# EAGLE board InteractionBoard (EAGLE 9.6.2)
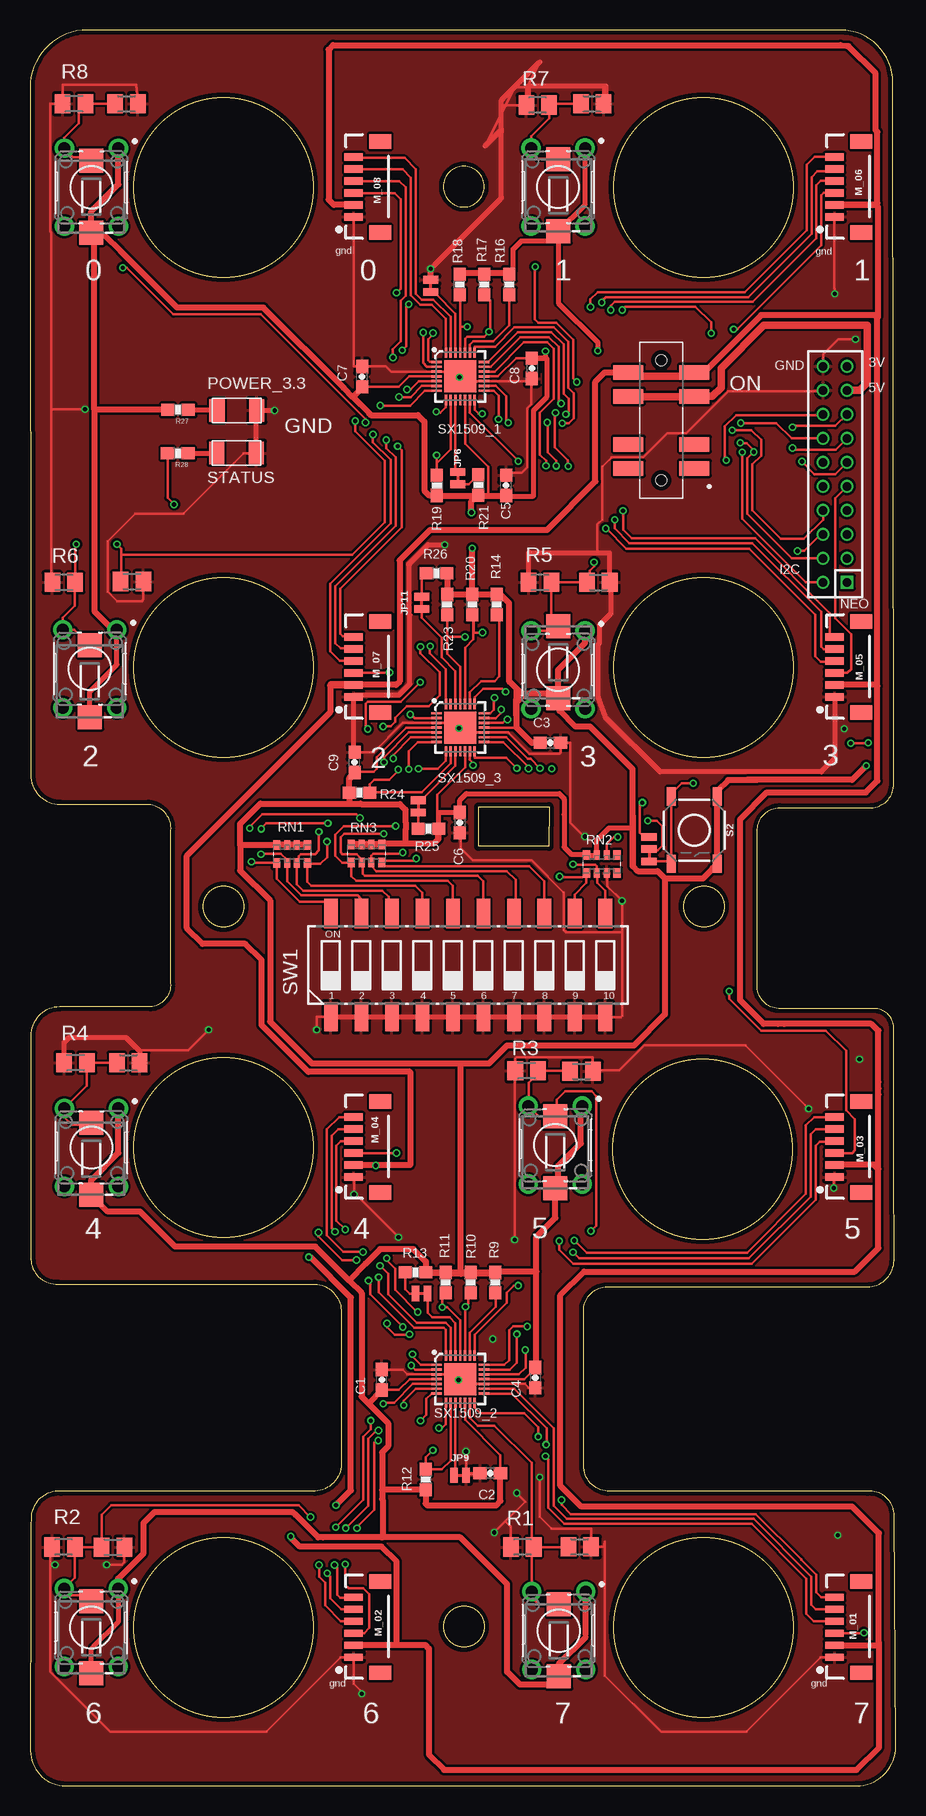
[diagram p5: board, top side]
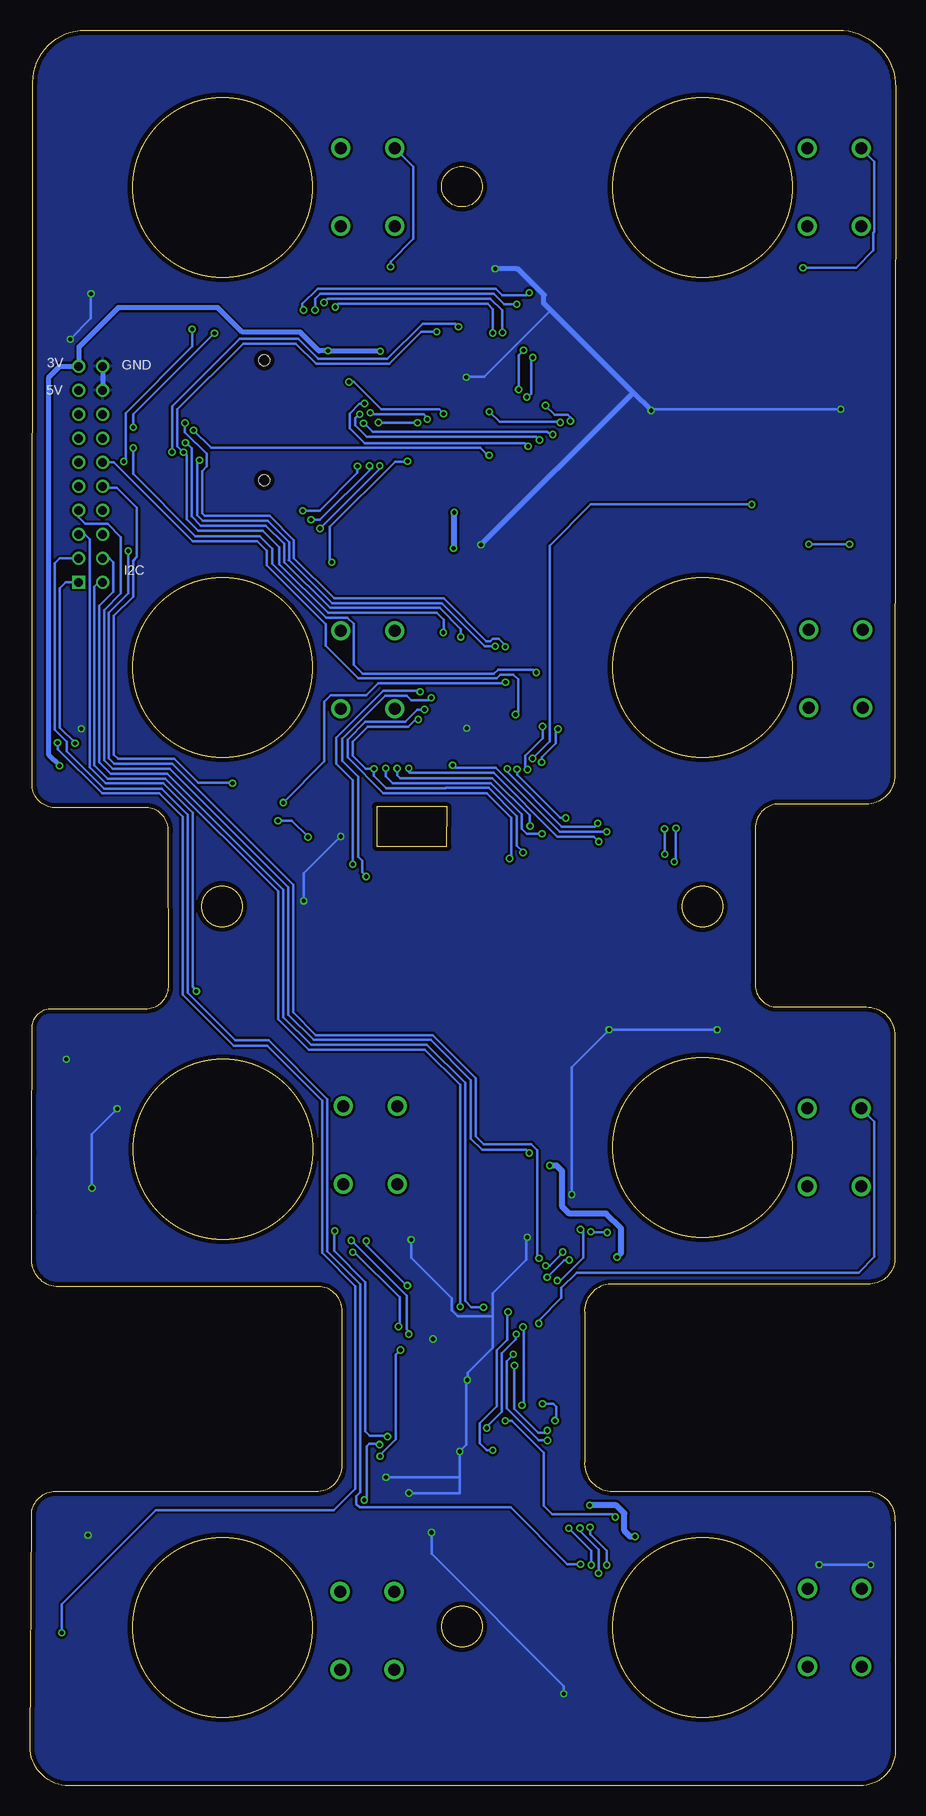
[diagram p6: board, bottom side, seen from below]

Size 72.14 x 146.32 mm. Coordinates in mm from the lower left corner, seen from the top.
Outline: 43.23,78.29 37.39,78.28 37.37,81.58 43.26,81.59 43.23,78.29
Outline: 71.97,63.21 arc87 70.33,64.77 62.38,64.77 arc-90 60.59,66.74 60.6,79.52 arc-90 62.48,81.52 70.1,81.51 arc90 71.96,83.5 71.9,141.95 arc90 67.53,146.32 4.8,146.32 arc90 0,141.51 0.06,84.23 arc90 2.49,81.8 9.88,81.8 arc-90 11.7,79.61 11.7,66.9 arc-90 10.02,64.9 2.46,64.9 arc90 0.06,62.5 0.06,43.87 arc90 2.34,41.81 23.74,41.81 arc-90 25.93,39.41 25.93,27.03 arc-90 23.77,24.54 2.57,24.54 arc88 0.09,22.48 0.05,21.53 0.05,10.47 0.03,10.09 0.03,2.92 arc90 2.96,0 68.89,0.01 arc90 72.14,3.28 72.01,22.7 arc90 69.81,24.54 48.12,24.54 arc-90 46.13,26.89 46.13,39.58 arc-90 48.11,41.58 69.76,41.58 arc90 72,43.79 72,47.47 71.99,47.79 71.99,52.59 71.98,52.95 71.98,57.82 71.97,58.14 71.97,63.21
Outline: 36.15,131.57 arc180 36.15,134.97 arc180 36.15,131.57
Outline: circle at 16.12,73.26 radius 1.7
Outline: circle at 36.16,13.27 radius 1.7
Outline: circle at 56.16,73.28 radius 1.7
Outline: circle at 16.12,13.2 radius 7.49
Outline: circle at 16.12,53.2 radius 7.49
Outline: circle at 16.12,133.2 radius 7.49
Outline: circle at 56.12,93.2 radius 7.49
Outline: circle at 56.12,133.2 radius 7.49
Outline: circle at 56.05,53.04 radius 7.49
Outline: circle at 16.12,93.2 radius 7.49
Outline: circle at 56.12,13.2 radius 7.49
Copper layers (1*16): Top 0.035559375mm / dielectric 1.6mm / Bottom 0.035559375mm
Design rules "oshpark-2layer-tented": minimum track width 6mil, minimum drill 10mil, track to track 6mil, track to pad 6mil, pad to pad 6mil, via to via 6mil, smd to smd 6mil, copper to edge 15mil, drill to drill 6mil, minimum pad ring 5mil, minimum via ring 5mil, stop-mask expansion 2.5mil, vias tented up to drill 20mil, thermal gap 10mil
Net classes: 0 default: width 0.2 mm, clearance 0.2 mm; 1 gnd: width 0.3 mm, clearance 0.2 mm to class 0, clearance 0.2 mm; 2 3v: width 0.2 mm, clearance 0.2 mm; 4 5v: width 0.4 mm, clearance 0.2 mm to class 0, clearance 0.2 mm

## Footprints (pad centres in the part's own frame; a part is rotated, then mirrored left to right if it is on the bottom)
0603-CAP = smd 1.1 x 1: 1 -0.85,0; 2 0.85,0
DIL-2MM-2X10 = drill 0.711 square: 1 -9,-1 | drill 0.711: 2 -9,1; 3 -7,-1; 4 -7,1; 5 -5,-1; 6 -5,1; 7 -3,-1; 8 -3,1; 9 -1,-1; 10 -1,1; 11 1,-1; 12 1,1; 13 3,-1; 14 3,1; 15 5,-1; 16 5,1; 17 7,-1; 18 7,1; 19 9,-1; 20 9,1
SMT-JUMPER_3_1-NC_TRACE_NO-SILK = smd 0.635 x 1.27: 1 -1.016,0; 2 0,0; 3 1.016,0
SMT-JUMPER_2_NC_TRACE_NO-SILK = smd 0.635 x 1.27: 1 -0.508,0; 2 0.508,0
1X06-1MM = smd 0.6 x 1.55: 1 -2.54,1.27; 2 -1.54,1.27; 3 -0.54,1.27; 4 0.46,1.27; 5 1.46,1.27; 6 2.46,1.27 | smd 1.2 x 1.8: P$1 -3.84,-0.955; P$2 3.76,-0.955
LED1206FAB = smd 1.27 x 1.905: 1 -1.651,0; 2 1.651,0
M0805 = smd 1.3 x 1.6: 1 -0.95,0; 2 0.95,0
0603-RES = smd 1.1 x 1: 1 -0.85,0; 2 0.85,0
EXB38V = smd 0.6 x 0.8: 1 -1.275,-0.75; 4 1.275,-0.75; 5 1.275,0.75; 8 -1.275,0.75 | smd 0.5 x 0.8: 2 -0.4,-0.75; 3 0.4,-0.75; 6 0.4,0.75; 7 -0.4,0.75
SW_JS207011SCQNR = smd 2.5 x 1.2: 1 -2.75,4; 2 -2.75,2; 3 -2.75,-2; 4 -2.75,-4; 5 2.75,4; 6 2.75,2; 7 2.75,-2; 8 2.75,-4 | hole 0.9: 0,5; 0,-5
TACTILE_SWITCH_SMD_5.2MM = smd 1.524 x 0.762: 1 -2.794,1.905; 2 2.794,1.905; 3 -2.794,-1.905; 4 2.794,-1.905
CTS-219-10 = smd 1.13 x 2.44: 1 -11.43,-4.3; 2 -8.89,-4.3; 3 -6.35,-4.3; 4 -3.81,-4.3; 5 -1.27,-4.3; 6 1.27,-4.3; 7 3.81,-4.3; 8 6.35,-4.3; 9 8.89,-4.3; 10 11.43,-4.3; 11 11.43,4.3; 12 8.89,4.3; 13 6.35,4.3; 14 3.81,4.3; 15 1.27,4.3; 16 -1.27,4.3; 17 -3.81,4.3; 18 -6.35,4.3; 19 -8.89,4.3; 20 -11.43,4.3
B3F-1000 = drill 1 pad 1.6: 1 -3.25,2.25; 2 3.25,2.25; 3 -3.25,-2.25; 4 3.25,-2.25
DTSM-3 = smd 2 x 2: 1 -3,0; 2 3,0
QFN-28 = smd 0.85 x 0.2: 1 -1.975,1.2; 2 -1.975,0.8; 3 -1.975,0.4; 4 -1.975,0; 5 -1.975,-0.4; 6 -1.975,-0.8; 7 -1.975,-1.2; 15 1.975,-1.2; 16 1.975,-0.8; 17 1.975,-0.4; 18 1.975,0; 19 1.975,0.4; 20 1.975,0.8; 21 1.975,1.2 | smd 0.2 x 0.85: 8 -1.2,-1.975; 9 -0.8,-1.975; 10 -0.4,-1.975; 11 0,-1.975; 12 0.4,-1.975; 13 0.8,-1.975; 14 1.2,-1.975; 22 1.2,1.975; 23 0.8,1.975; 24 0.4,1.975; 25 0,1.975; 26 -0.4,1.975; 27 -0.8,1.975; 28 -1.2,1.975 | smd 2.65 x 2.65: 29 0,0

## Placement (x,y rotation side)
C1  0.1uF  [0603-CAP]  29.32,33.83 90 top
C2  0.1uF  [0603-CAP]  38.35,26.05 180 top
C3  0.1uF  [0603-CAP]  43.36,86.91 0 top
C4  0.1uF  [0603-CAP]  42.11,34.01 270 top
C5  0.1uF  [0603-CAP]  39.67,108.37 90 top
C6  0.1uF  [0603-CAP]  35.8,80.26 270 top
C7  0.1uF  [0603-CAP]  27.68,117.43 90 top
C8  0.1uF  [0603-CAP]  41.83,118.12 270 top
C9  0.1uF  [0603-CAP]  27.05,85.29 90 top
J3  F-2X10-DIL-2MM  [DIL-2MM-2X10]  67.08,109.29 90 top
JP1  JUMPER-SMT_3_1-NC_TRACE_NO-SILK  [SMT-JUMPER_3_1-NC_TRACE_NO-SILK]  51.59,78.06 270 top
JP6  JUMPER-SMT_2_NC_TRACE_NO-SILK  [SMT-JUMPER_2_NC_TRACE_NO-SILK]  35.65,108.97 270 top
JP7  JUMPER-SMT_2_NC_TRACE_NO-SILK  [SMT-JUMPER_2_NC_TRACE_NO-SILK]  33.39,125 90 top
JP8  JUMPER-SMT_2_NC_TRACE_NO-SILK  [SMT-JUMPER_2_NC_TRACE_NO-SILK]  32.62,41.02 180 top
JP9  JUMPER-SMT_2_NC_TRACE_NO-SILK  [SMT-JUMPER_2_NC_TRACE_NO-SILK]  35.84,25.88 0 top
JP10  JUMPER-SMT_2_NC_TRACE_NO-SILK  [SMT-JUMPER_2_NC_TRACE_NO-SILK]  32.36,81.62 270 top
JP11  JUMPER-SMT_2_NC_TRACE_NO-SILK  [SMT-JUMPER_2_NC_TRACE_NO-SILK]  32.65,98.58 90 top
M_01  [1X06-1MM]  68.31,13.26 90 top
M_02  [1X06-1MM]  28.23,13.26 90 top
M_03  [1X06-1MM]  68.31,53.27 90 top
M_04  [1X06-1MM]  28.23,53.27 90 top
M_05  [1X06-1MM]  68.31,93.27 90 top
M_06  [1X06-1MM]  68.31,133.28 90 top
M_07  [1X06-1MM]  28.23,93.27 90 top
M_08  [1X06-1MM]  28.23,133.28 90 top
POWER_3.3  LEDFAB1206  [LED1206FAB]  17.24,114.61 0 top
R1  10k  [M0805]  41.03,19.9 0 top
R2  10k  [M0805]  2.8,19.9 0 top
R3  10k  [M0805]  41.39,59.59 0 top
R4  10K  [M0805]  3.8,60.25 0 top
R5  10k  [M0805]  42.51,100.28 0 top
R6  10k  [M0805]  2.82,100.28 0 top
R7  10k  [M0805]  46.85,140.16 180 top
R8  10k  [M0805]  3.67,140.16 0 top
R9  10K  [0603-RES]  38.78,41.93 90 top
R10  10K  [0603-RES]  36.74,41.93 90 top
R11  10K  [0603-RES]  34.66,41.93 90 top
R12  10K  [0603-RES]  32.97,25.52 270 top
R13  10K  [0603-RES]  32.13,42.8 0 top
R14  10K  [0603-RES]  38.9,98.43 90 top
R16  10K  [0603-RES]  39.94,125.1 90 top
R17  10K  [0603-RES]  37.86,125.11 90 top
R18  10K  [0603-RES]  35.81,125.1 90 top
R19  10K  [0603-RES]  33.91,108.37 270 top
R20  10K  [0603-RES]  36.84,98.43 90 top
R21  10K  [0603-RES]  37.37,108.4 270 top
R23  10K  [0603-RES]  34.75,98.43 90 top
R24  10K  [0603-RES]  27.47,82.76 180 top
R25  10K  [0603-RES]  33.21,79.76 0 top
R26  10K  [0603-RES]  33.89,101.05 0 top
R27  500  [0603-RES]  12.34,114.66 180 top
R28  500  [0603-RES]  12.31,111.04 180 top
RN1  [EXB38V]  21.84,77.65 0 top
RN2  [EXB38V]  47.64,76.81 0 top
RN3  [EXB38V]  28.04,77.68 0 top
S1  JS207011SCQNR  [SW_JS207011SCQNR]  52.61,113.78 180 top
S2  [TACTILE_SWITCH_SMD_5.2MM]  55.35,79.64 270 top
STATUS  LEDFAB1206  [LED1206FAB]  17.21,111.06 0 top
SW1  219-10  [CTS-219-10]  36.51,68.38 0 top
SWB_1  B3F-1000  [B3F-1000]  44.06,12.93 270 top
SWB_2  B3F-1000  [B3F-1000]  5.09,13.19 270 top
SWB_3  B3F-1000  [B3F-1000]  43.78,53.4 270 top
SWB_4  B3F-1000  [B3F-1000]  5.12,53.19 270 top
SWB_5  B3F-1000  [B3F-1000]  44.01,93 270 top
SWB_6  B3F-1000  [B3F-1000]  4.99,93.09 270 top
SWB_7  B3F-1000  [B3F-1000]  44.01,133.23 270 top
SWB_8  B3F-1000  [B3F-1000]  5.12,133.2 270 top
SWITCH_M1  DTSM-3  [DTSM-3]  44.08,12.12 90 top
SWITCH_M2  DTSM-3  [DTSM-3]  5.09,12.37 90 top
SWITCH_M3  DTSM-3  [DTSM-3]  43.78,52.77 90 top
SWITCH_M4  DTSM-3  [DTSM-3]  5.08,52.27 90 top
SWITCH_M5  DTSM-3  [DTSM-3]  44.01,93.64 90 top
SWITCH_M6  DTSM-3  [DTSM-3]  4.99,92.05 90 top
SWITCH_M7  DTSM-3  [DTSM-3]  44.03,132.55 90 top
SWITCH_M8  DTSM-3  [DTSM-3]  5.12,132.44 90 top
SWR_1  10K  [M0805]  45.81,19.92 180 top
SWR_2  10K  [M0805]  6.92,19.89 180 top
SWR_3  10K  [M0805]  45.96,59.53 180 top
SWR_4  10K  [M0805]  8.19,60.25 180 top
SWR_5  10K  [M0805]  47.36,100.28 180 top
SWR_6  10K  [M0805]  8.49,100.35 180 top
SWR_7  10K  [M0805]  42.31,140.06 0 top
SWR_8  10K  [M0805]  8.04,140.16 180 top
SX1509_2  SX1509  [QFN-28]  35.85,33.89 0 top
SX1509_3  SX1509  [QFN-28]  35.85,88.18 0 top
U2  SX1509  [QFN-28]  35.85,117.45 0 top

## Tracks (layer width: path | path; a pad name or v marks a point on that pad's centre or on a via)
0_SX1  (via drill 0.35)
  Top 0.2: M_04.6 25.76,55.73 24.73,54.7 24.73,45.9 26.11,44.51 27.73,44.51 v27.75,44.49 | SX1509_2.27 35.05,38.17 34.65,38.57 32.22,38.57 29.83,40.96 29.83,42.68 v29.17,43.34
  Bottom 0.2: v29.17,43.34 28.81,43.34 27.75,44.4 v27.75,44.49
0_SX2
  Top 0.2: U2.27 35.05,122.41 33.61,123.85 32.65,123.85 32.15,124.35 32.15,134.73 31.22,135.67 27.03,135.67 M_08.6
1_SX1  (via drill 0.35)
  Top 0.2: M_04.5 25.68,54.73 25.13,54.18 25.13,46.46 v25.41,46.18 | SX1509_2.28 34.65,38.01 34.49,38.17 32.02,38.17 29.05,41.14 v29.05,42.37 | v27.21,43.81 26.01,43.81 24.03,45.78 v24.03,46.11
  Bottom 0.2: v25.41,46.18 25.34,46.11 v24.03,46.11 | v27.21,43.81 27.61,43.81 v29.05,42.37
1_SX2
  Top 0.2: M_08.5 27,134.7 31.05,134.7 31.74,134 31.74,124.19 32.5,123.43 33.47,123.43 34.65,122.25 U2.28
1_SX3  (via drill 0.35)
  Top 0.2: SX1509_3.28 34.65,93.04 33.3,94.39 33.3,94.9 v33.36,94.96 | v58.01,110.47 57.9,110.58 57.9,113.29 58.84,114.23 65.77,114.23 65.83,114.29 J3.16
  Bottom 0.2: v33.36,94.96 34.25,94.96 37.84,98.55 46.98,98.55 50.55,102.12 | 50.55,102.12 50.57,102.14 | 50.55,102.12 50.55,103.63 52.34,105.42 57.73,105.42 58.2,105.89 58.2,110.47 v58.01,110.47
2_SX1  (via drill 0.35)
  Top 0.2: SX1509_2.1 32.57,35.09 31.87,35.78 v31.87,35.95 | M_02.6 26.91,15.67 25.87,15.67 25.62,15.92 25.62,18.16 v25.37,18.4 | v27.25,21.46 27.25,21.57 28.67,22.99 28.67,28.57 28.86,28.76 29,28.76 v29.02,28.78
  Bottom 0.2: v31.87,35.95 31.87,35.91 32.41,35.37 32.41,31.48 29.74,28.81 29.05,28.81 v29.02,28.78 | v25.37,18.4 25.37,19.58 v27.25,21.46
2_SX2  (via drill 0.35)
  Top 0.2: M_06.6 67.02,135.76 65.41,135.76 64.73,135.08 64.73,129.63 59.56,124.46 47.3,124.46 46.7,123.86 v46.7,123.23 | U2.1 33.32,118.65 33.18,118.79 33.18,120.56 33.58,120.96 v33.58,121.07
  Bottom 0.2: v33.58,121.07 33.6,121.09 33.58,121.1 33.58,123.06 34.01,123.49 46.44,123.49 v46.7,123.23
3.3V  (via drill 0.35)
  Top 0.2: U2.18 38.99,117.45 40.51,118.97 41.66,118.97 C8.1 | U2.4 31.61,117.45 30.73,116.58 C7.1 | 37.24,107.52 37.34,107.52 R21.2 38.18,107.55 | 38.18,107.55 38.43,107.55 38.43,107.52 C5.1 39.6,107.44 39.6,107.39 | 27.24,84.44 C9.1 27.11,84.49 28.66,84.49 28.91,84.73 28.91,85.72 31.36,88.18 SX1509_3.4 | R23.2 34.88,99.28 R20.2 36.98,99.28 38.76,99.28 R14.2 | C4.1 42.11,34.81 41.18,33.89 SX1509_2.18 | SX1509_2.4 31.65,33.89 30.74,32.98 C1.1 | R18.2 35.82,125.96 R17.2 39.93,125.96 R16.2 | SX1509_3.12 36.25,84.89 33.93,82.58 33.93,79.89 R25.2 | SX1509_2.12 36.25,30.5 39.2,27.55 C2.1 | U2.12 36.25,111.84 38.18,109.91 38.18,107.55 | SX1509_3.18 40.55,88.18
  Top 0.305: 34.45,79.76 34.13,79.76 R25.2 | R26.2 34.74,99.43 34.88,99.28 | R23.2 36.98,99.28 | R20.2 38.76,99.28 | 37.24,107.52 39.47,107.52 39.6,107.39 | R18.2 R16.2 | 50.25,80.88 50.25,81 | 50.25,81 50.27,81.02 | 50.25,81 50.25,84.68 | 27.05,84.26 C9.1 26.62,84.01 26.62,82.88 26.44,82.69
  Top 0.4: R13.2 33.1,42.68 34.56,42.68 R11.2 34.78,42.66 35.9,42.66 36.62,42.66 R10.2 36.81,42.71 38.71,42.71 R9.2 38.88,42.88 40.51,42.88 40.74,42.88 | 43.49,49.49 SWITCH_M3.1 | 43.48,90.64 SWITCH_M5.1 | RN3.5 RN3.7 RN3.8 26.89,78.55 28.56,78.55 | RN1.8 RN1.7 RN1.5 | C8.1 43.05,118.97 43.05,115.71 41.94,114.6 41.94,107.49 41.89,107.44 39.75,107.44 C5.1 | 26.88,115.79 28.44,114.23 | 26.17,116.5 19.49,123.18 12.25,123.18 | R16.2 40.06,126.07 40.25,126.26 40.25,128.05 40.93,128.73 43.21,128.73 SWITCH_M7.1 | SWITCH_M7.1 46.26,131.77 SWB_7.1 | v42.95,119.55 42.95,118.97 41.66,118.97 | SWITCH_M7.1 44.03,123.57 47.31,120.28 v47.31,119.58 | 57.33,82.97 57.33,82.5 S2.1 | SWITCH_M6.1 4.99,91.19 7.24,93.44 7.24,96.09 SWB_6.1 6.91,96.34 5.37,97.88 | 34.06,79.69 34.13,79.76 | 34.06,79.69 R25.2 34.06,81.11 C6.1 35.82,81.12 35.82,82.13 36.37,82.68 44.1,82.68 | 34.06,79.69 34.06,78.92 34.02,78.88 | RN3.6 28.56,78.55 | 28.56,78.55 29.44,78.55 31.27,78.55 31.38,78.55 | 31.38,78.55 33.69,78.55 | 50.25,79.82 50.25,80.88 50.25,84.68 | 50.25,79.82 50.25,76.62 | 44.08,90.56 44.14,90.51 44.51,90.14 | 50.25,79.82 48.26,79.82 47.24,78.8 RN2.7 RN2.8 46.34,77.59 45.15,77.59 44.52,78.22 | RN1.5 23.03,78.31 | 5.27,11.57 5.09,11.39 | 9.47,21.91 10.42,22.85 21.84,22.85 22.13,22.57 | 24.43,20.69 28.5,20.69 | 29.04,32.7 C1.1 | 32.83,24.53 R12.2 | SWITCH_M8.1 5.37,129.19 5.37,128.91 | RN1.6 RN1.5 | 31.37,78.56 31.38,78.55 | 26.62,82.09 R24.2
  Top 0.406: 28.5,20.69 29.27,20.69 29.39,20.69 35.87,20.69 | 40.97,91.01 40.78,90.81 40.55,90.58 40.55,88.18 | 50.25,84.68 50.22,84.71 | 44.1,82.68 44.52,82.27 44.52,82.2 44.52,80.95 | 44.52,80.95 | 44.52,80.95 44.52,78.23 44.52,78.22 | 46.31,12.39 46.31,12.66 | 46.31,15.94 SWB_1.1 | SWITCH_M2.1 5.09,11.39 | SWB_2.1 7.34,13.64 5.27,11.57
  Top 0.508: 35.9,42.66 35.9,60.14 35.84,60.2 | S2.2 57.33,76.91 | 56.88,76.46 S2.2 | 60.58,83.82 59.7,83.82 | 59.7,83.82 58.17,83.82 57.33,82.97 | v69.68,85 68.51,83.82 59.71,83.82 59.7,83.82 | 26.6,42.11 23.77,44.93 12.1,44.93 9.17,47.86 6.49,47.86 SWITCH_M4.1 5.08,50.46 7.37,52.75 SWB_4.1 | 17.51,78.38 17.53,78.4 RN1.8 RN1.5 | 17.51,78.38 17.51,80.16 19.2,81.85 26.62,81.85 | R24.2 26.62,84.01 C9.1 | R24.2 26.62,83.84 27.05,84.26 | 17.51,78.38 17.51,76.27 20,73.78 20,63.68 23.49,60.2 35.84,60.2 | 29.34,24.67 29.34,27.79 29.83,28.28 29.83,30.23 28.22,31.85 | 29.39,20.69 29.39,20.81 | 29.39,23.85 29.39,24.76 | SWB_3.1 46.03,56.38 45.91,56.26 45.91,53.55 43.99,51.63 43.99,49.98 SWITCH_M3.1 43.78,47.33 42.19,45.74 42.19,42.84 | 42.24,87.19 C3.1 41.82,86.91 40.55,88.18 | SWITCH_M5.1 44.08,90.56 | SWITCH_M5.1 43.64,91.01 41.24,91.01 | 41.24,91.01 40.97,91.01 40.5,91.48 | R26.2 34.75,101.04 R23.2 R14.2 39.2,99.28 39.9,98.58 39.9,92.07 39.98,92 40.5,91.48 | 37.24,107.52 R19.2 33.28,107.52 32.87,107.92 32.87,113.68 32.32,114.23 28.44,114.23 28.41,114.23 28.28,114.37 28.26,114.37 26.9,115.73 | 37.24,107.52 C5.1 39.75,107.44 | R18.2 35.93,126.07 40.06,126.07 | 40.5,91.48 40.5,90.53 | 40.5,90.27 41.24,91.01 | 52.89,75.62 52.3,76.21 50.66,76.21 50.25,76.62 50.22,76.65 50.22,84.71 46.67,88.26 45.45,88.26 44.14,89.58 44.14,90.51 SWITCH_M5.1 | 52.89,75.62 56.09,75.62 57.26,76.79 S2.2 | 52.89,75.62 52.91,75.59 52.91,64.28 50.33,61.7 39.75,61.7 38.25,60.2 35.84,60.2 | 28.22,31.85 27.63,32.43 27.63,41.07 26.6,42.11 | 28.22,31.85 28.22,31.88 C1.1 | R12.2 29.34,24.67 | 40.51,42.88 42.16,42.88 42.19,42.84
  Top 0.508: 42.19,42.84 38.84,42.84 38.71,42.71 | 34.78,42.66 38.66,42.66 R9.2 38.75,42.8 R13.2 32.98,43.68 31.94,44.71 29.18,44.71 27.98,43.51 27.98,43.48 26.6,42.11 | C4.1 42.19,34.95 42.19,42.84 | 40.55,88.18 40.55,89.18 40.5,89.23 40.5,90.27 | 40.5,90.27 40.5,90.53 | 40.5,90.53 40.78,90.81 | R12.2 32.97,23.5 33.1,23.37 38.83,23.37 39.2,23.74 C2.1 | 46.31,12.39 44.08,10.17 SWITCH_M1.1 43.39,8.43 40.83,8.43 39.76,9.5 39.76,16.8 35.87,20.69 29.27,20.69 | 46.31,12.66 46.31,15.94 | 29.27,20.69 24.43,20.69 24,20.69 22.13,22.57 21.87,22.83 10.39,22.83 9.47,21.91 9.47,19.39 7.34,17.26 SWB_2.1 | SWITCH_M5.1 44.01,92.99 46.26,95.24 SWB_5.1 | 27.6,116.5 C7.1 27.68,116.5 26.9,115.73 | 26.17,116.5 26.13,116.5 | 26.13,116.5 19.45,123.18 12.26,123.18 12.25,123.18 7.55,127.88 7.55,127.9 6.27,129.19 5.37,129.19 | SWITCH_M8.1 5.12,131.2 7.37,133.45 SWB_8.1 | R27.2 5.37,114.66 | 5.37,114.66 5.37,128.91 | 5.37,114.66 5.37,97.88 7.16,96.09 7.24,96.09 | R20.2 v36.84,103.13 | v36.78,106.1 36.78,107.06 37.24,107.52 | 29.34,24.67 29.34,23.9 29.39,23.85 | R12.2 33.02,24.67 | 29.39,23.85 29.39,20.81 | 29.39,20.81 29.27,20.69 | 26.13,116.5 26.9,115.73 | S2.2 S2.1 | R24.2 26.62,81.85 | 26.63,81.86 26.62,81.85 | 26.62,81.85 27.54,81.85 27.59,81.81 30.82,81.81 31.27,81.36 31.27,80.33 31.29,80.31 31.29,79.69 31.27,79.67 31.27,78.55 | RN3.5 29.44,78.55 33.69,78.55 34.02,78.88 34.02,79.72 R25.2
  Bottom 0.4: 64.8,123.18 68.05,119.93 68.05,118.32 J3.19 69.66,118.29 70.57,117.38 70.57,85.89 v69.68,85 | v42.95,119.55 42.97,119.57 v47.3,119.57 v47.31,119.58 48,119.58
  Bottom 0.406: 48,119.58 48.07,119.58 49.63,121.15 54.45,121.15 56.48,123.18 64.8,123.18
  Bottom 0.508: v36.84,103.13 36.84,106.04 v36.78,106.1
3_SX1  (via drill 0.35)
  Top 0.2: M_02.5 25.95,14.72 25.04,15.63 25.04,17.43 v24.76,17.71 | SX1509_2.2 32.09,34.69 31.77,35 v31.77,35.02 | v29.04,29.61 28.9,29.61 28.19,28.9 28.19,23.34 26.32,21.47 v26.31,21.47
  Bottom 0.2: v31.77,35.02 31.77,31.41 29.79,29.42 29.23,29.42 v29.04,29.61 | v26.31,21.47 26.31,21.23 24.77,19.69 v24.77,17.72 v24.76,17.71
3_SX2  (via drill 0.35)
  Top 0.2: M_06.5 66.84,134.53 65.61,134.53 65.13,134.05 65.13,129.34 59.86,124.06 47.98,124.06 47.65,123.74 v47.65,123.61 | v32.76,121.1 32.76,118.57 33.08,118.25 U2.2
  Bottom 0.2: v32.76,121.1 32.78,121.1 32.78,122.94 33.77,123.93 47.34,123.93 47.65,123.62 v47.65,123.61
3_SX3  (via drill 0.35)
  Top 0.2: SX1509_3.2 32.08,88.98 31.77,89.28 v31.68,89.28
  Bottom 0.2: J3.12 65.15,110.29 58.58,103.72 53.21,103.72 52.4,102.91 52.4,101.72 47.5,96.82 47.5,95 44.78,92.28 33.25,92.28 32.95,92.59 31.85,92.59 31.47,92.2 31.47,89.5 v31.68,89.28
4_SX1  (via drill 0.35)
  Top 0.2: M_02.4 25.9,13.72 24.6,15.02 24.6,16.92 24.08,17.43 v24.08,18.39 v24.09,18.39 | v28.39,30.43 28.39,29.69 27.79,29.09 27.79,23.85 v25.48,21.54 v25.47,21.54 | v29.43,31.83 29.53,31.93 30.34,31.93 31.89,33.49 SX1509_2.5
  Bottom 0.2: v24.09,18.39 24.09,18.69 24.1,18.7 24.1,19.59 25.47,20.96 v25.47,21.54 | v28.39,30.43 28.27,30.55 28.27,31.57 28.53,31.83 v29.43,31.83
4_SX2  (via drill 0.35)
  Top 0.2: U2.5 32.41,117.05 31.72,116.36 v31.42,116.36 | M_06.4 65.9,133.74 65.53,133.37 65.53,128.95 60.24,123.66 48.72,123.66 48.39,123.33 v48.39,122.98 | v31.57,123.46 31.37,123.26 31.37,119.98 v31.02,119.63
  Bottom 0.2: v31.57,123.46 32.63,123.46 33.5,124.33 47.96,124.33 48.39,123.91 v48.39,122.98 | v31.02,119.63 31.42,119.23 v31.42,116.36
4_SX3  (via drill 0.35)
  Top 0.2: v29.51,85.3 29.51,85.73 31.56,87.78 SX1509_3.5 | JP1.1 51.48,79.18 51.07,79.18 50.81,79.44 50.81,81.78 50.95,81.93 v51.03,81.93 | v32.51,91.95 30.9,90.33 28.16,90.33 27.99,90.16 27.99,88.06 v28.14,88.06
  Bottom 0.2: v51.03,81.93 47.61,85.36 47.61,90.32 47.06,90.86 44.13,90.86 43.13,91.87 32.45,91.87 32.45,91.89 v32.51,91.95 | v28.14,88.06 28.34,87.86 28.34,86.9 29.51,85.73 v29.51,85.3
5_SX1  (via drill 0.35)
  Top 0.2: M_04.4 25.92,53.73 25.53,53.34 25.53,47.1 v26.27,46.36 | SX1509_2.6 32.14,33.09 31.14,32.09 v31.14,31.71 | v28.21,42.1 28.33,41.98 28.33,40.98 31.06,38.25 v31.06,38.23
  Bottom 0.2: v26.27,46.36 26.06,46.16 26.06,43.99 27.95,42.1 v28.21,42.1 | v31.06,38.23 31.01,38.18 31.01,31.84 v31.14,31.71
5_SX2  (via drill 0.35)
  Top 0.2: M_08.4 26.99,133.71 30.78,133.71 31.29,133.19 31.29,124.16 30.89,123.76 30.89,120.38 30.24,119.73 v30.24,119.03 | v30.74,115.73 31.74,115.73 32.67,116.65 U2.6
  Bottom 0.2: v30.74,115.73 30.67,115.73 30.38,116.02 30.38,118.89 v30.24,119.03
5_SX3  (via drill 0.35)
  Top 0.2: SX1509_3.6 31.75,87.38 30.26,85.89 v30.26,85.61 | R28.2 11.46,107.32 v12,106.78
  Bottom 0.2: v30.26,85.61 28.82,87.05 28.82,103.35 25.39,106.78 v12,106.78
6_SX1  (via drill 0.35)
  Top 0.2: SWITCH_M2.2 4.57,15.9 3.38,15.9 SWB_2.3 3.73,17.32 3.73,19.88 R2.2 5.96,19.9 SWR_2.2 5.97,22.6 6.76,23.38 22.38,23.38 v23.37,22.39 | SX1509_2.7 33.87,32.68 33.46,32.68 33.03,32.25 33.03,30.9 v32.55,30.41
  Bottom 0.2: v23.37,22.39 23.6,22.62 28.62,22.62 29.32,23.32 29.32,27.74 32,30.41 v32.55,30.41
6_SX2  (via drill 0.35)
  Top 0.2: R6.2 3.72,100.23 3.72,98.33 2.74,97.36 SWB_6.3 3.7,96.34 SWITCH_M6.2 | R6.2 3.84,100.35 | U2.7 32.91,116.25 31.69,115.02 v29.19,115.02 | 7.61,100.42 SWR_6.2 | v27.11,113.73 27.11,113.6 27.12,113.59 27.12,112.86 29.57,110.41 29.57,105.3 26.85,102.58 7.61,102.58 7.61,103.08 v7.24,103.45 | R6.2 3.77,103.37 v3.84,103.45
  Top 0.203: 7.61,102.58 7.61,100.42
  Bottom 0.2: v29.19,115.02 28.41,114.25 27.32,114.25 27.11,114.04 v27.11,113.73 | v3.84,103.45 v7.24,103.45
6_SX3  (via drill 0.35)
  Top 0.2: SW1.20 25.08,73.56 24.96,73.68 22.49,73.68 20.57,75.61 RN1.1 18.57,76.9 v18.46,77.01 | SX1509_3.7 33.85,86.95 32.3,86.95 31.55,86.2 v31.55,84.72 | v18.32,79.79 18.32,79.92 19.35,80.95 27.19,80.95 v27.49,80.65
  Bottom 0.2: v31.55,84.72 31.55,84.26 27.94,80.65 v27.49,80.65 | v18.46,77.01 18.32,77.16 v18.32,79.79
7_SX1  (via drill 0.35)
  Top 0.2: SWR_4.2 R4.2 4.75,58.32 SWB_4.3 2.87,55.73 3.52,55.08 4.97,55.08 5.08,55.2 SWITCH_M4.2 | SX1509_2.8 34.65,30.12 34.32,29.79 34.1,29.79 v34.07,29.82 | v31.62,37.64 31.56,37.58 30.41,37.58 29.75,38.23 v29.75,38.53
  Bottom 0.2: v34.07,29.82 34.07,29.92 32.83,31.16 32.83,36.04 31.66,37.21 31.66,37.6 v31.62,37.64 | SWB_4.3 1.77,55.34 1.77,44.07 3.06,42.77 26.59,42.77 27.85,41.51 27.85,40.65 29.71,38.8 29.6,38.69 v29.75,38.53
7_SX2  (via drill 0.35)
  Top 0.2: SWR_8.2 R8.2 4.07,139.62 4.07,138.56 2.87,137.35 SWB_8.3 3.62,135.7 4.86,135.7 SWITCH_M8.2 | U2.8 34.65,114.87 34.2,114.42 33.94,114.42 v33.86,114.5 | v27.96,113.61 27.96,113.88 19.22,122.62 11.95,122.62 8.08,126.5 v7.73,126.5
  Bottom 0.2: v27.96,113.61 28,113.65 33.01,113.65 v33.86,114.5 | v7.73,126.5 3.31,126.5 1.86,127.94 1.86,129.4 1.77,129.5 1.77,135.35 SWB_8.3
7_SX3  (via drill 0.35)
  Top 0.2: SW1.19 27.56,72.74 27.56,73.94 27.29,74.2 22.62,74.2 21.44,75.38 RN1.2 21.44,77.15 20.91,77.68 19.3,77.68 v19.24,77.62 | v24.82,80.2 19.69,80.2 19.27,79.79 v19.27,79.74 | v32.38,84.75 33.98,84.75 34.65,85.42 SX1509_3.8
  Bottom 0.2: v24.82,80.2 24.82,80.17 25.06,79.93 27.82,79.93 32.38,84.49 v32.38,84.75 | v19.27,79.74 19.24,79.71 v19.24,77.62
8_SX1
  Top 0.2: SWITCH_M1.2 42.34,15.12 41.81,15.65 SWB_1.3 41.81,19.73 R1.2 | R1.2 44.84,19.9 SWR_1.2 | SX1509_2.13 36.65,30.66 37.29,30.02 38.7,30.02 41.82,26.9 41.82,20.05 R1.2
8_SX2  (via drill 0.35)
  Top 0.2: SWB_5.3 43.62,96.25 SWITCH_M5.2 43.46,97.19 R5.2 SWR_5.2 46.41,100.63 46.63,100.85 46.63,101.25 47,101.62 v47,101.95 | U2.13 36.65,114.43 40.68,110.41 v40.68,110.39
  Bottom 0.2: v40.68,110.39 40.71,110.36 41.71,110.36 47.16,104.91 47.16,102.11 v47,101.95
8_SX3  (via drill 0.35)
  Top 0.2: SW1.18 29.88,72.96 29.88,74.07 29.35,74.6 22.79,74.6 22.24,75.15 RN1.3 22.39,77.05 22.39,77.48 22.55,77.64 23.76,77.64 24.07,77.96 v24.07,79.51 | SX1509_3.13 36.65,85.49 36.92,85.22 v36.92,85.05
  Bottom 0.2: v36.92,85.05 36.71,84.84 33.33,84.84 27.99,79.51 v24.07,79.51
9_SX1  (via drill 0.35)
  Top 0.2: SWR_3.2 44.95,59.59 R3.2 42.34,59.39 41.55,58.6 41.55,56.66 SWB_3.3 42.4,55.77 SWITCH_M3.2 43.91,55.91 43.91,57.16 44.62,57.87 46.8,57.87 47.19,57.48 47.19,46.69 v46.74,46.24 | SX1509_2.14 37.05,31.51 37.51,31.05 41.19,31.05 42.35,29.9 v42.35,29.1
  Bottom 0.2: v42.35,29.1 42.43,29.18 43.83,29.18 44.19,29.54 44.19,41.98 46.8,44.59 46.8,46.18 v46.74,46.24
9_SX2  (via drill 0.35)
  Top 0.2: R7.2 43.36,140.16 SWR_7.2 43.26,138.96 41.76,137.46 SWB_7.3 41.76,136.09 42.27,135.58 44,135.58 SWITCH_M7.2 | U2.14 37.06,115.47 37.06,114.68 37.41,114.34 v37.69,114.34 | v42.09,126.59 42.06,126.56 42.06,122.22 42.35,121.93 43.84,121.93 45.27,120.5 45.27,117.67 45.26,117.68 45.26,117.28 v45.55,116.99
  Bottom 0.2: v37.69,114.34 38.04,114.69 42.86,114.69 45.16,116.99 v45.55,116.99 | v42.09,126.59 42.09,127.01 40.19,128.91 40.19,134.92 SWB_7.3
9_SX3  (via drill 0.35)
  Top 0.2: 32.7,73.43 SW1.17 32.7,74.4 32.1,75 23.43,75 23.12,75.32 RN1.4 23.2,76.82 24.21,76.82 24.75,77.37 v24.75,78.68 | 37.05,85.78 SX1509_3.14 37.05,85.66 39.7,85.66 v40.57,84.79
  Bottom 0.2: v24.75,78.68 25.18,79.11 28.19,79.11 33.5,84.42 38.28,84.42 40.49,84.42 40.57,84.5 v40.57,84.79
10_SX1  (via drill 0.35)
  Top 0.2: M_01.6 65.92,15.72 65.5,16.14 65.5,17.6 64.27,18.83 64.27,18.86 60.49,22.64 45.06,22.64 44.29,23.41 v44.29,23.81 | v43.01,28.43 43.05,28.48 43.05,29.8 40.16,32.69 SX1509_2.15
  Bottom 0.2: 44.2,23.81 v44.29,23.81 44.25,23.81 44.09,23.97 44.09,28.29 43.88,28.5 43.08,28.5 v43.01,28.43 v43,28.43
10_SX2  (via drill 0.35)
  Top 0.2: M_05.6 66.88,95.73 66.67,95.95 66.67,97.72 60.43,103.95 50.14,103.95 49.44,104.65 49.44,106.23 v49.41,106.26 | v43.79,114.41 43.72,114.34 43.72,111.53 44.8,110.45 44.8,110.01 v44.85,109.96 | v39.04,113.88 39.04,115.84 38.63,116.25 U2.15
  Bottom 0.2: v43.79,114.41 43.67,114.29 39.32,114.29 39.04,114.01 v39.04,113.88 | v49.41,106.26 47.99,106.26 44.85,109.4 v44.85,109.96
10_SX3  (via drill 0.35)
  Top 0.2: SW1.16 35.24,74.99 34.83,75.4 27.19,75.4 26.78,75.81 26.78,76.92 RN3.1 26.01,76.93 25.45,77.49 25.45,79.25 26.16,79.96 30.45,79.96 v30.47,79.98 | SX1509_3.15 39.45,86.98 41.55,84.88 v41.55,84.78
  Bottom 0.2: v30.47,79.98 30.52,79.93 30.52,80.87 33.61,83.96 41.28,83.96 41.55,84.23 v41.55,84.78
11_SX1
  Top 0.2: M_01.5 65.46,14.72 65.1,15.08 65.1,17.44 60.3,22.24 44.72,22.24 43.64,23.32 43.64,29.78 40.34,33.09 SX1509_2.16
11_SX2  (via drill 0.35)
  Top 0.2: M_05.5 67.02,94.71 66.14,94.71 65.92,94.94 65.92,97.83 60.19,103.55 49.95,103.55 48.72,104.78 v48.72,105.5 | U2.16 38.83,116.65 39.69,115.79 39.69,113.75 v39.85,113.59 | v43.85,109.99 43.85,110.4 43.13,111.12 43.13,113.58 v43.1,113.61
  Bottom 0.2: v43.1,113.61 43.08,113.59 v39.85,113.59 | v43.85,109.99 43.67,109.81 47.98,105.5 v48.72,105.5
11_SX3  (via drill 0.35)
  Top 0.2: SW1.15 37.78,75.37 37.33,75.82 27.88,75.82 27.71,75.99 27.71,76.86 RN3.2 27.66,76.95 27.66,77.22 27.24,77.63 26.03,77.63 25.88,77.78 25.88,79.05 26.18,79.34 v29.47,79.34 | SX1509_3.16 39.68,87.38 41.47,85.58 41.71,85.58 42.49,84.8 v42.5,84.8
  Bottom 0.2: v29.47,79.34 29.59,79.34 29.6,79.35 30.77,79.35 31.16,79.74 31.16,80.95 33.76,83.55 37.86,83.55 37.87,83.55 41.92,83.55 42.5,84.13 v42.5,84.8
12_SX1  (via drill 0.35)
  Top 0.2: M_01.4 65.32,13.72 64.7,14.33 64.7,17.27 60.14,21.84 44.54,21.84 43.2,23.19 43.2,27.22 v42.97,27.45 | SX1509_2.19 40.74,34.29 41.3,34.85 41.3,36.27 v41.26,36.31
  Bottom 0.2: v41.26,36.31 41.66,35.91 41.66,28.89 42.97,27.59 v42.97,27.45
12_SX2  (via drill 0.35)
  Top 0.2: M_05.4 66.99,93.68 65.88,93.68 65.46,94.11 65.46,97.6 59.95,103.1 49.7,103.1 48.02,104.78 v47.97,104.78 | U2.19 38.73,117.85 41.16,120.28 43.09,120.28 43.63,119.74 43.63,115.57 42.48,114.42 42.48,110.93 43,110.41 v43,110.01
  Bottom 0.2: v43,110.01 43,109.75 v47.97,104.78
12_SX3  (via drill 0.35)
  Top 0.2: 39.99,72.68 SW1.14 40.47,72.84 40.47,75.49 39.74,76.23 28.87,76.23 28.48,76.62 28.48,76.89 RN3.3 28.44,77.49 28.6,77.65 30.94,77.65 v31.06,77.77 | v39.78,88.86 v39.79,88.87 39.68,88.87 39.39,88.58 SX1509_3.19
  Bottom 0.2: v31.06,77.77 31.06,77.82 31.58,78.34 31.58,80.8 33.93,83.15 37.5,83.15 42.46,83.15 43.48,84.17 v43.48,84.75 44.16,84.75 45.23,85.83 45.23,87.01 44,88.23 40.63,88.23 40,88.86 v39.78,88.86
13_SX1  (via drill 0.35)
  Top 0.2: M_03.6 67.03,55.71 65.34,55.71 64.67,55.03 64.67,49.32 59.76,44.42 46.39,44.42 v45.36,45.45 | v40.57,37.64 40.57,35.27 39.99,34.69 SX1509_2.20
  Bottom 0.2: v45.36,45.45 45.15,45.24 40.74,40.82 40.74,38.03 40.57,37.87 v40.57,37.64
13_SX2  (via drill 0.35)
  Top 0.2: M_07.6 26.91,95.78 26.06,95.78 25.84,96.01 25.84,99.75 30.96,104.87 30.96,111.29 v30.63,111.62 | U2.20 38.39,118.25 40.86,120.73 43.24,120.73 44.06,119.91 44.06,115.4 v44.26,115.2
  Bottom 0.2: v30.63,111.62 30.9,111.89 44.26,111.89 45.51,113.14 45.51,114.34 44.69,115.16 44.26,115.16 v44.26,115.2
13_SX3  (via drill 0.35)
  Top 0.2: SW1.13 42.86,75.38 41.6,76.64 29.61,76.64 RN3.4 29.47,77.08 31.99,77.08 v32.18,77.28 | v39.26,89.68 39.26,89.41 38.83,88.98 SX1509_3.20
  Bottom 0.2: v32.18,77.28 32.02,77.44 32.02,80.68 34.06,82.72 42.69,82.72 45.68,85.71 45.68,87.15 44.19,88.65 40.88,88.65 39.87,89.66 39.29,89.66 v39.26,89.68 39.29,89.68
14_SX1  (via drill 0.35)
  Top 0.2: M_03.5 65.48,54.73 65.07,54.31 65.07,49.11 59.9,43.94 45.78,43.94 v45.25,44.47 | v41.43,38.27 41.39,38.31 40.27,38.31 39.92,37.95 39.92,35.47 39.54,35.09 SX1509_2.21
  Bottom 0.2: v41.43,38.27 41.34,38.36 41.34,40.7 45.11,44.47 v45.25,44.47
14_SX2  (via drill 0.35)
  Top 0.2: M_07.5 26.91,94.78 25.88,94.78 25.43,95.23 25.43,99.97 30.48,105.01 30.48,110.69 29.69,111.48 v29.69,112.15 | v44.66,114.3 44.89,114.54 44.89,115.59 44.46,116.02 44.46,120.11 43.44,121.13 40.65,121.13 38.18,118.65 U2.21
  Bottom 0.2: v44.66,114.3 44.73,114.23 44.75,114.23 45.03,113.94 45.03,113.37 44.08,112.42 29.96,112.42 v29.69,112.15
14_SX3  (via drill 0.35)
  Top 0.2: SW1.12 45.4,74.27 46.37,75.25 RN2.1 46.03,75.72 44.18,75.72 v44.13,75.77 | SX1509_3.21 38.35,89.38 38.64,89.67 38.64,90.61 v38.7,90.67
  Bottom 0.2: v38.7,90.67 38.89,90.48 40.36,90.48 40.73,90.85 42.55,90.85 46.13,87.27 46.13,85.41 44.81,84.09 44.8,77.41 44.47,77.08 44.47,76.11 v44.13,75.77
15_SX1  (via drill 0.35)
  Top 0.2: M_03.4 66.98,53.66 65.79,53.66 65.47,53.33 65.47,48.84 60.15,43.52 45.25,43.52 44.11,44.66 v44.11,45.4 44.06,45.4 | SX1509_2.22 37.05,37.59 39.71,40.25 39.71,41.08 40.31,41.68 v40.69,41.68
  Bottom 0.2: v44.11,45.4 44.11,45.05 40.74,41.68 v40.69,41.68
15_SX2  (via drill 0.35)
  Top 0.2: M_07.4 26.95,93.74 25.82,93.74 25.01,94.55 25.01,100.16 30.05,105.2 30.05,110.51 28.58,111.98 v28.58,112.61 | U2.22 37.05,119.93 38.76,119.93 40.36,121.53 43.64,121.53 44.86,120.32 44.86,116.5 45.31,116.05 45.31,113.97 44.89,113.55 v44.35,113.55
  Bottom 0.2: v28.58,112.61 28.8,112.61 29.04,112.85 43.59,112.85 44.35,113.61 v44.35,113.55
15_SX3  (via drill 0.35)
  Top 0.2: SW1.11 47.94,74.57 47.27,75.24 47.27,76.03 RN2.2 47.24,76.63 47.1,76.77 45.26,76.77 v45.24,76.79 | v39.63,91.17 39.37,91.43 37.78,91.43 37.06,90.71 SX1509_3.22
  Bottom 0.2: v39.63,91.17 39.72,91.25 42.72,91.25 46.61,87.35 46.61,85.17 45.25,83.81 45.25,79.39 45.24,79.38 v45.24,76.79
!RESET_SX1
  Top 0.2: R9.1 38.82,41.04 38.82,39.94 36.65,37.77 SX1509_2.23
!RESET_SX2
  Top 0.2: U2.23 36.65,120.1 36.92,120.37 38.62,120.37 39.94,121.69 R16.1
!RESET_SX3
  Top 0.2: SX1509_3.23 36.65,91.12 | 39.11,93.39 39.11,93.48 39.11,97.37 R14.1
  Top 0.203: 39.11,93.48 39.11,92.45 38.71,92.05 37.58,92.05 36.65,91.12
ADDR0_SX1
  Top 0.2: SX1509_2.26 35.45,38.56 34.99,39.03 33.53,39.03 33.13,39.42 JP8.1
ADDR0_SX2
  Top 0.2: U2.26 35.45,122.68 33.85,124.28 33.53,124.28 33.39,124.42 JP7.1 33.18,124.28 33.17,124.28 32.96,124.49
ADDR0_SX3
  Top 0.2: JP11.1 32.65,98.03 | JP11.1 32.65,97.85 | 32.65,98 32.65,98.01 JP11.1 | SX1509_3.26 35.45,92.89 34.31,94.04 34.31,95.69 32.66,97.34 32.66,97.33 32.65,97.34 JP11.1
ADDR1_SX1
  Top 0.2: JP9.1 35.45,26.01 SX1509_2.10
ADDR1_SX2
  Top 0.2: U2.10 35.45,109.48 JP6.1
ADDR1_SX3
  Top 0.2: 31.93,82.13 31.94,82.14 JP10.1 32.58,82.13 35.45,85 SX1509_3.10
GND_MCU  (via drill 0.35)
  Top 0.2: 41.7,117.26 41.68,117.27 C8.2 | C8.2 41.61,117.05 U2.17 37.11,117.05 36.71,117.45 U2.29 | C9.2 28.64,86.14 31.08,88.58 SX1509_3.3 35.45,88.58 SX1509_3.29 | C4.2 41.57,33.16 41.25,33.49 SX1509_2.17 36.25,33.49 SX1509_2.29 | C1.2 31.04,34.68 31.44,34.29 SX1509_2.3 35.45,34.29 SX1509_2.29 | JP9.2 36.33,26.05 | U2.29 35.45,117.85 U2.3 30.09,117.85 29.67,118.28 C7.2 26.96,118.28 M_08.1 | SX1509_3.29 36.25,87.78 SX1509_3.17 39.84,87.78 41.62,86 44.12,86 44.21,86.1 C3.2 45.02,86.91 45.02,82.16 45.02,80.74 45.02,80.26 46.16,79.11 v46.25,79.11 | JP7.2 33.39,126.33 33.43,126.37 | C5.2 39.87,109.41 40.99,109.41 41.44,109.86 41.44,114.81 41.77,115.13 41.77,117.21 C8.2 | 33.43,126.37 39.28,132.22 39.28,132.37 | 39.28,137.86 39.28,137.99 39.28,140.06 SWR_7.1 41.36,141.39 42.49,143.66 | RN2.3 48.1,76.01 48.1,74.98 v49.33,73.74 49.33,71.11 | SW1.10 47.96,64.06 49.23,64.06 49.33,64.16 49.33,71.11 | 1.68,18.41 1.68,19.71 1.78,19.81 R2.1 | 1.68,18.41 1.68,9.51 6.68,4.51 19.68,4.51 25.88,10.71 26.88,10.71 M_02.1 26.96,8.51 27.65,7.82 v27.65,7.66 | v6.38,18.41 7.65,18.41 7.87,18.63 SWR_2.1 | 1.68,18.41 v2.08,18.41 | v66.98,49.81 66.98,50.71 | v64.88,56.41 59.58,61.71 51.18,61.71 49.08,59.61 46.98,59.61 SWR_3.1 46.91,60.71 40.56,60.71 40.44,60.59 R3.1 40.38,59.51 v40.38,45.51 | M_01.1 66.98,10.71 65.88,10.71 59.68,4.51 52.58,4.51 47.91,9.18 47.91,20.33 47.82,19.92 SWR_1.1 46.76,21.41 43.48,21.41 42.48,22.41 v42.48,25.71 | v35.7,33.81 35.78,33.81 SX1509_2.29 | v36.33,27.86 36.33,26.04 36.54,25.83 36.54,26.01 | v30.71,45.71 27.14,49.28 v27,49.28 27,50.7 M_04.1 | v40.55,24.39 41.26,23.69 39.61,22.04
  Top 0.2: R1.1 40.08,21.57 39.61,22.04 | v38.68,21.11 39.61,22.04 | 1.78,114.71 1.78,129.41 1.68,129.51 1.68,140.16 R8.1 2.72,141.76 8.86,141.76 8.99,140.43 SWR_8.1 | 1.78,114.71 1.78,100.31 R6.1 | SWR_6.1 9.44,98.87 9.29,98.72 7.27,98.72 6.48,99.51 6.48,103.71 8.78,106.01 12.78,106.01 17.81,111.04 17.89,111.06 STATUS.2 | v35.78,117.37 35.78,117.41 U2.29 | v33.38,126.41 33.43,126.37 | 47.78,140.21 47.78,141.56 40.38,141.56 37.92,136.65 | 47.78,140.21 47.99,139.56 | 47.78,140.21 R7.1 | v4.58,114.71 1.78,114.71 | M_06.1 67.03,130.73 67.03,124.76 67.06,124.73 v67.06,124.34 | J3.20 66.08,119.3 67.33,120.55 v68.79,120.55 | v35.75,88.13 35.78,88.11 SX1509_3.29 | 41.56,102.92 41.59,102.91 41.59,102.77 | 49.33,71.11 44.68,71.11 44.48,71.31 44.48,74.42 41.79,77.11 36.88,77.11 35.88,78.11 35.88,79.41 C6.2 | 9.28,61.31 13.18,61.31 v14.88,63.01 | v23.88,63.01 23.88,64.08 SW1.1 | 47.28,102.75 47.28,102.77 47.28,105.11 47.68,105.51 47.68,109.91 48.48,110.71 51.08,110.71 53.08,112.71 54.68,112.71 58.18,116.21 66.08,116.21 J3.18 | 34.56,103.53 v34.56,103.42
  Top 0.305: 36.33,26.05 36.54,26.05 | 36.54,26.01 37.46,26.01 C2.2
  Top 0.4: STATUS.2 18.86,114.59 POWER_3.3.2 | SW1.1 SW1.2 SW1.3 SW1.4 SW1.5 SW1.6 SW1.7 SW1.8 SW1.9 SW1.10 | R4.1 2.85,61.95 3.26,62.37 7.99,62.37 9.14,61.23 SWR_4.1 | R5.1 41.56,102.77 41.59,102.77 47.28,102.77 | 47.28,102.75 48.28,102.75 48.28,100.31 SWR_5.1 48.41,100.18 48.41,97.68 47.47,96.73 47.47,95.23 47.37,95.14 47.37,90.7 47.99,89 52.51,84.49 65.95,84.49 67.04,85.58 M_05.1 | C9.2 26.96,86.22 M_07.1
  Top 0.406: M_07.1 27.14,90.91 30.76,90.91 31.65,91.8 31.65,97.55 31.61,97.59 31.61,101.74 31.55,101.79 33.18,103.42 v34.56,103.42 | v33.38,126.41 39.28,132.31 39.28,132.37 39.28,137.86 | 39.28,137.99 39.28,138.01 | 39.28,138.01 39.28,140.45 42.49,143.66 | 37.92,136.65 39.28,138.01 | SWR_7.1 41.51,140.21 41.51,141.66 47.99,141.66 47.99,139.56 | POWER_3.3.2 v20.38,114.61
  Top 0.508: JP7.2 v33.38,126.41
  Bottom 0.2: v46.25,79.11 49.33,76.03 v49.33,73.74 | v2.08,18.41 v6.38,18.41 | v66.98,49.81 66.98,54.31 v64.88,56.41 | v30.71,45.71 30.79,45.63 30.79,43.84 33.58,41.05 33.58,39.11 | 33.58,39.11 33.58,36.51 35.68,34.41 35.68,33.81 v35.7,33.81 35.78,33.81 35.78,28.41 v36.33,27.86 36.33,25.71 | 36.33,25.71 36.33,24.39 v40.55,24.39 | 36.33,25.71 v42.48,25.71 | v40.38,45.51 40.38,44.01 36.98,40.61 36.98,39.61 36.48,39.11 33.58,39.11 | v38.68,21.11 38.68,19.33 27.65,8.3 v27.65,7.66 | 28.74,122.97 34.3,117.41 35.78,117.41 v35.78,117.37 | 31.48,126.41 31.58,126.41 | 29.33,123.56 28.74,122.97 | 28.74,122.97 21.88,116.11 | 21.88,116.11 21.79,116.02 v20.38,114.61 20.38,114.71 v4.58,114.71 | v67.06,124.34 67.06,122.28 v68.79,120.55 | v14.88,63.01 v23.88,63.01 27,59.89 v27,49.28 | v34.56,103.42 21.88,116.11
  Bottom 0.4: J3.20 J3.18
  Bottom 0.406: v34.56,103.42 21.96,116.02 21.79,116.02 | v20.38,114.61 21.88,116.11 29.33,123.56 29.33,124.16 29.28,124.21 31.48,126.41 | 31.58,126.41 v33.38,126.41
  other vias: 67.31,20.87 69.12,60.54 38.55,37.23 67.86,88.08
  pour Top (isolate 0.005): -8.46,155.82 78.42,155.82 78.42,-4.36 -8.46,-4.36
  pour Bottom (isolate 0.005): -0.74,147.48 72.22,147.48 72.22,0.05 -0.74,0.05
INT_01  (via drill 0.35)
  Top 0.2: SX1509_2.9 35.05,27.09 34.33,26.37 R12.1 32.97,27.36 v33.57,27.96 | v29.72,43.95 29.72,43.78 30.43,43.08 30.43,41.33 32.27,39.48 v32.3,39.48 | v63.95,102.9 64.5,102.9 65.89,104.29 J3.6
  Bottom 0.2: v33.57,27.96 34.09,27.96 34.68,28.55 34.68,30.19 33.23,31.65 33.23,36.3 32.36,37.16 32.36,39.42 v32.3,39.48 | 30.38,53.48 34.34,53.48 34.99,54.13 34.99,58.95 38.6,62.55 48.32,62.55 50.22,64.45 50.22,75.08 60.3,85.16 65.1,85.16 65.56,85.62 65.56,97.77 63.95,99.38 v63.95,102.9
  Bottom 0.203: v29.72,43.95 29.87,44.1 29.87,52.97 30.38,53.48
INT_02  (via drill 0.35)
  Top 0.2: U2.9 35.05,111.36 33.91,110.22 R19.1 33.88,109.25 v33.88,110.87 | v58.52,112.96 60.11,112.96 60.92,112.15 60.92,110.85 60.18,110.11 60.18,106.29 62.57,103.9 64.47,103.9 66.08,105.51 J3.8
  Bottom 0.2: v33.88,110.87 33.99,110.87 34.61,111.49 57.05,111.49 v58.52,112.96
INT_03  (via drill 0.35)
  Top 0.2: SX1509_3.9 35.05,85.22 32.65,82.81 28.32,82.81 R24.1
  Top 0.203: R24.1 28.32,83.45 28.69,83.82 29.94,83.82 30.69,84.57 v30.69,84.69 | J3.14 63.47,112.29 62.2,113.56 v59.23,113.56 | v32.54,94.91 32.54,94.38 34.14,92.79 34.14,90.86 33.23,89.96 31.41,89.96 30.44,88.99 30.44,88.66 30.06,88.28 v29.43,88.28
  Bottom 0.203: v30.69,84.69 30.89,84.89 30.89,85.84 29.43,87.3 v29.43,88.28 | v32.54,94.91 32.54,95.03 33.09,95.59 33.59,95.59 33.8,95.38 34.11,95.38 37.68,98.95 46.81,98.95 50.14,102.29 50.14,103.8 52.17,105.82 57.57,105.82 57.8,106.06 57.8,109.57 57.41,109.96 57.41,110.99 59.23,112.82 v59.23,113.56
N$5
  Top 0.2: R21.1 36.57,108.45 35.66,108.45 JP6.2
N$8
  Top 0.2: JP8.2 31.63,41.02 31.26,41.38 31.26,42.78 R13.1
N$13
  Top 0.4: R28.1 15.54,111.04 STATUS.1
N$14
  Top 0.2: JP10.2 R25.1
N$15
  Top 0.2: JP11.2 32.65,100.66 R26.1
N$193
  Top 0.4: R27.1 15.53,114.66 POWER_3.3.1
NEOPIXEL_01  (via drill 0.35)
  Top 0.2: M_01.3 69.46,12.72 v69.49,12.76 | v69.84,86.91 69.82,86.89 68.39,86.89 v68.39,86.88
  Bottom 0.2: v69.84,86.91 69.82,86.89 69.82,86.39 66.14,82.7 61.36,82.7 59.39,80.74 59.39,65.91 55.15,61.66 52.39,61.66 47.79,57.07 47.79,44.42 45.02,41.64 45.02,24.77 46.81,22.97 61.64,22.97 69.49,15.12 v69.49,12.76 | v68.39,86.88 68.39,86.91 69.65,88.17 69.65,99.81 69.17,100.29 J3.1
NEOPIXEL_02  (via drill 0.35)
  Top 0.2: M_02.3 27.86,12.72 28.28,13.15 28.28,15.95 27.78,16.45 26.55,16.45 26.27,16.73 v26.27,18.45
  Bottom 0.2: v26.27,18.45 27.35,18.45 32.09,23.19 44.65,23.19 44.94,23.48 44.94,24.12 44.61,24.45 44.61,41.8 47.35,44.54 47.35,57.22 52.25,62.11 55.03,62.11 58.99,66.08 58.99,80.92 61.18,83.1 65.97,83.1 69.08,86.21 69.08,87 70.07,88 70.07,101.87 69.65,102.29 J3.3
NEOPIXEL_03  (via drill 0.35)
  Top 0.2: M_03.3 68.52,52.73 68.73,52.94 68.73,55.56 68,56.29 68,61.24 66.33,62.92 60.93,62.92 58.28,65.57 v58.28,66.22
  Bottom 0.2: J3.5 67.57,104.29 67.17,103.89 67.17,84.87 65.83,83.53 61.03,83.53 58.59,81.09 58.59,66.58 58.28,66.26 v58.28,66.22
NEOPIXEL_04  (via drill 0.35)
  Top 0.2: v30.53,52.73 M_04.3
  Bottom 0.2: v30.53,52.73 30.79,52.99 34.46,52.99 35.39,53.92 35.39,58.78 38.76,62.15 48.51,62.15 50.62,64.26 50.62,74.87 60.51,84.75 65.26,84.75 65.96,85.46 65.96,92.99 65.97,93 65.97,97.96 64.56,99.37 64.56,104.06 65.65,105.15 67.53,105.15 68.08,105.7 J3.7
NEOPIXEL_05
  Top 0.2: M_05.3 68.12,92.73 68.43,93.05 68.43,95.94 67.08,97.29 67.08,107.29 J3.9
NEOPIXEL_06  (via drill 0.35)
  Top 0.2: M_06.3 66.13,132.74 65.93,132.54 65.93,128.38 58.94,121.38 v58.63,121.38 | J3.11 67.09,109.3 65.35,109.3 64.33,110.32 v64.33,110.35
  Bottom 0.2: v64.33,110.35 64.31,110.35 64.18,110.48 64.18,114.4 58.63,119.94 v58.63,121.38
NEOPIXEL_07  (via drill 0.35)
  Top 0.2: J3.13 67.13,111.34 63.67,111.34 v63.53,111.48 | v29.96,92.77 29.93,92.73 M_07.3
  Bottom 0.2: v63.53,111.48 63.53,111.14 63.55,111.12 63.55,109.32 58.38,104.14 52.99,104.14 51.95,103.1 51.95,101.83 47.45,97.33 46.73,97.33 46.71,97.35 45.69,97.35 45.16,96.82 45.16,93.4 44.43,92.68 33.48,92.68 33.14,93.02 30.21,93.02 v29.96,92.77
NEOPIXEL_08  (via drill 0.35)
  Top 0.2: v63.54,113.22 63.65,113.33 67.12,113.33 J3.15 | 30.85,124.73 v30.55,124.42 30.89,124.77 30.89,132.21 30.38,132.73 26.97,132.73 M_08.3 | v49.34,122.98 49.62,123.26 55.45,123.26 56.77,121.94 v56.77,121.05
  Bottom 0.2: v30.55,124.42 30.76,124.21 32.77,124.21 33.31,124.75 43.49,124.75 43.51,124.76 48.16,124.76 49.44,123.48 49.44,123.08 v49.34,122.98 | v56.77,121.05 56.79,121.05 63.55,114.29 v63.55,113.23 v63.54,113.22
RESET  (via drill 0.35)
  Top 0.2: RN2.6 48.04,78.44 48.67,79.07 v48.97,79.07 | 51.44,78.2 JP1.2 | v51.48,80.42 52.23,80.42 52.68,79.97 52.68,78.35 52.3,77.97 51.67,77.97 JP1.2 | JP1.2 JP1.3 51.61,77.06 53.23,77.06 S2.4 S2.3 53.45,82.66 54.33,83.54 v55.27,83.54
  Bottom 0.2: v48.97,79.07 50.32,80.42 v51.48,80.42 | v55.27,83.54 55.3,83.57 58.12,83.57 60.12,85.57 64.8,85.57 65.14,85.91 65.14,97.52 63.55,99.11 63.55,102.08 63.23,102.4 63.23,106.5 64.89,108.16 65.95,108.16 J3.10
SCL_00  (via drill 0.35)
  Top 0.2: U2.25 35.85,121.58 | 35.85,121.58 35.85,123.88 35.73,124 35.73,124.17 R18.1 | SX1509_3.25 35.85,93.25 34.75,94.35 R23.1 34.75,95.74 v36.25,95.74 | SX1509_2.25 35.85,38.78 34.75,39.88 v34.34,39.88 | 34.34,40.76 R11.1 | 34.34,40.76 34.33,40.75 | v34.34,39.88 34.33,39.9 | J3.4 63.48,102.29 59.76,106.02 59.76,110.65 60.25,111.14 v60.3,111.14 v60.31,111.15 60.31,111.31 59.73,111.89 59.22,111.89 v59.19,111.92 | v36.44,121.58 35.85,121.58 | v34.34,39.88 34.34,40.76
  Bottom 0.2: v34.34,39.88 35.36,39.88 35.88,40.4 35.88,58.57 39.06,61.75 48.72,61.75 51.02,64.05 51.02,74.67 60.69,84.34 65.41,84.34 66.36,85.29 66.36,92.82 66.37,92.83 66.37,98.34 65.21,99.5 65.21,101.97 65.53,102.29 J3.4 | v60.3,111.14 60.3,114.95 54.66,120.59 49.79,120.59 48.12,118.92 42.36,118.92 39.43,121.85 36.71,121.85 v36.44,121.58 | v36.25,95.74 36.25,96.4 38.01,98.15 47.14,98.15 50.97,101.98 50.97,103.48 52.5,105.02 57.9,105.02 58.68,105.8 58.68,111.44 59.16,111.92 v59.19,111.92
SDA_00  (via drill 0.35)
  Top 0.2: U2.24 36.25,120.57 36.45,120.77 37.85,120.77 v38.24,121.16 38.28,121.21 38.29,121.2 | R17.1 38.37,123.75 38.37,121.28 38.29,121.2 | v38.24,121.15 38.29,121.2 | SX1509_3.24 36.25,94.85 36.94,95.54 36.94,97.48 R20.1 36.97,97.45 36.97,96.09 37.69,96.09 v37.71,96.11 | 36.82,41 R10.1 36.61,41.21 36.52,41.21 36.52,40.15 v36.28,39.91 36.25,39.88 SX1509_2.24 | v59.35,111.12 59.36,111.11 59.36,105.6 64.66,100.29 J3.2
  Bottom 0.2: v36.28,39.91 36.28,58.41 39.23,61.35 48.93,61.35 51.45,63.88 51.45,74.53 60.85,83.93 65.67,83.93 66.77,85.04 66.77,99.93 66.41,100.29 J3.2 | v38.24,121.16 39.56,121.16 42.22,118.49 48.3,118.49 49.99,120.18 54.38,120.18 59.86,114.7 59.86,111.61 59.38,111.12 v59.35,111.12 59.09,110.86 59.09,105.54 58.13,104.58 52.74,104.58 51.37,103.21 51.37,101.81 47.31,97.75 38.25,97.75 37.66,97.16 37.66,96.16 v37.71,96.11
VCC_5V  (via drill 0.35)
  Top 0.4: 56.14,117.77 56.12,117.78 S1.4 | 67.55,131.74 67.27,131.74 | 67.5,91.73 M_05.2 | M_03.2 67.08,51.76 67.44,51.76 67.6,51.76 | 70.8,11.94 70.76,11.9 | 27.19,51.73 M_04.2 | 31.6,51.73 31.67,51.8 | 68.48,23.25 68.52,23.25 68.56,23.22
  Top 0.508: M_02.2 30.55,11.71 | 30.55,11.71 32.96,11.71 33.23,11.44 33.23,2.6 34.51,1.32 68.89,1.32 70.76,3.19 70.76,11.9 | M_01.2 70.58,11.72 70.76,11.9 | 70.76,11.9 70.74,11.92 70.74,21.04 | 70.74,21.04 70.74,21.07 | 70.74,21.04 68.56,23.22 68.5,23.22 | 56.14,117.77 60.93,122.56 70.4,122.56 70.64,122.33 | M_08.2 25.32,131.74 24.88,132.18 24.88,144.69 25.24,145.05 67.53,145.05 68.07,145 68.19,144.97 70.46,142.69 70.46,137.98 70.62,137.83 70.62,131.91 70.46,131.74 67.27,131.74 M_06.2 70.54,131.74 70.64,131.64 70.64,122.33 | S1.8 47.89,117.78 47.12,117.01 47.12,108.69 43.08,104.65 33.34,104.65 30.8,102.11 30.8,92.02 30.52,91.73 M_07.2 26.5,91.73 | 25.09,91.75 25,91.67 25,89.45 13.07,77.52 13.07,71.48 14.39,70.16 17.95,70.16 19.3,68.82 19.3,63.39 23.2,59.49 31.67,59.49 31.67,51.73 31.6,51.73 27.19,51.73 | 70.7,51.38 70.32,51.76 67.44,51.76 | 70.7,51.38 70.7,57.62 70.7,58.12 70.69,58.63 70.7,58.65 70.7,62.92 70.12,63.5 62.87,63.5 62.85,63.48 62.35,63.5 61.13,63.5 59.17,65.46 59.17,80.54 61.41,82.78 69.66,82.78 70.62,83.74 70.62,91.64 | 68.48,23.25 45.94,23.25 44.21,24.99 44.21,40.89 46.17,42.85 68.75,42.85 70.7,44.81 70.7,51.38 | 70.62,91.64 70.53,91.73 M_05.2 | 70.62,91.64 70.62,122.32 70.64,122.33 | 30.55,11.71 30.54,11.72 30.54,18.7 29.31,19.94 22.49,19.94 21.73,20.69 v21.73,20.77 | v25.49,23.37 26.74,24.62 26.74,40.69 23.38,44.06 v23.23,44.06
  Top 0.61: S1.4 55.05,117.47 50.17,117.47 S1.8 | 25.09,91.75 26.48,91.75 26.5,91.73
  Bottom 0.508: v21.73,20.77 22.13,20.77 22.62,21.26 22.62,22.7 23.29,23.37 v25.49,23.37 | v23.23,44.06 22.89,44.4 22.89,46.45 24.13,47.69 27.2,47.69 27.82,48.31 27.82,51.24 28.26,51.68 v28.82,51.68
VCC_5V_IN
  Top 0.61: S1.7 49.87,115.77 S1.3 56.87,115.78 57.59,116.5 57.59,118.13 61.15,121.69 69.78,121.69 69.78,116.91 69.16,116.29 J3.17

## Text on the board
tPlace: gnd | gnd | 0 | 0 | 1 | 1 | GND | 3V | ON | 5V | GND | SX1509_1 | I2C | NEO | 2 | 2 | 3 | 3 | 4 | 4 | 5 | 5 | gnd | gnd | 6 | 6 | 7 | 7
bPlace: GND | 3V | 5V | I2C